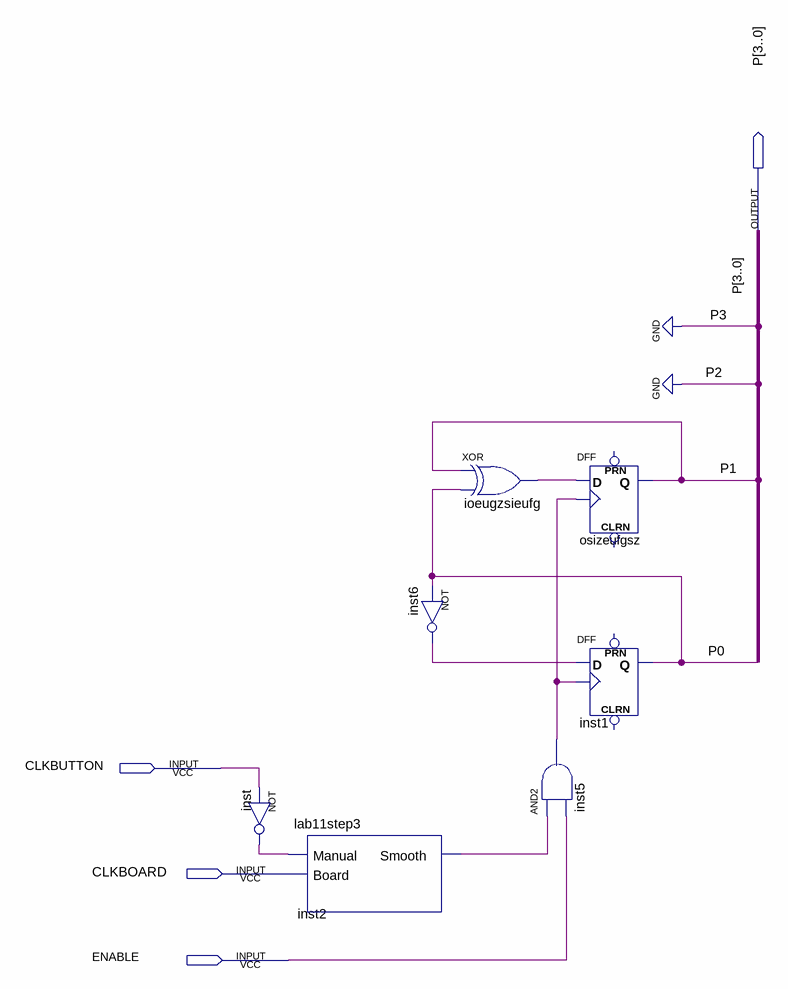
[diagram p0: schematic sheet]
// Quartus schematic mod4counter.bdf as structural Verilog: 7 symbols, 4 pins
module mod4counter (
  input  CLKBUTTON,
  input  CLKBOARD,
  input  ENABLE,
  output [3:0] P
);

  wire inst2_smooth, inst5_out, inst6_out, inst_out, ioeugzsieufg_out;

  not inst (inst_out, CLKBUTTON);
  lab11step3 inst2 (.Manual(inst_out), .Board(CLKBOARD), .Smooth(inst2_smooth));
  not inst6 (inst6_out, P[0]);
  xor ioeugzsieufg (ioeugzsieufg_out, P[1], P[0]);
  DFF osizeufgsz (.CLK(inst5_out), .D(ioeugzsieufg_out), .Q(P[1]));  // open: CLRN, PRN
  DFF inst1 (.CLK(inst5_out), .D(inst6_out), .Q(P[0]));  // open: CLRN, PRN
  and inst5 (inst5_out, inst2_smooth, ENABLE);

  assign P[3:2] = 2'b00;
endmodule
